# EAGLE design RS232 (EAGLE 4.14)
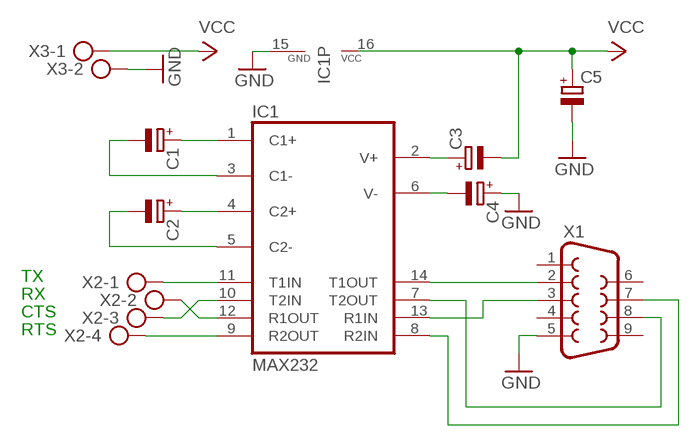
[diagram p0: schematic, sheet 1]

## Parts
C1  CPOL-EUE2-4  [E2-4]
C2  CPOL-EUE2-4  [E2-4]
C3  CPOL-EUE2-4  [E2-4]
C4  CPOL-EUE2-4  [E2-4]
C5  CPOL-EUE2-4  [E2-4]
IC1  MAX232  [DIL16]
X1  F09HP  [F09HP]
X2  AK300/4  [AK300/4]
X3  AK300/2  [AK300/2]

## Nets
GND: C4.+ C5.- IC1.15(GND) X1.5 X3.2
N$1: C1.- IC1.3(C1-)
N$2: C2.- IC1.5(C2-)
N$3: C1.+ IC1.1(C1+)
N$4: C2.+ IC1.4(C2+)
N$5: C4.- IC1.6(V-)
N$6: C3.+ IC1.2(V+)
N$7: IC1.11(T1IN) X2.1
N$8: IC1.12(R1OUT) X2.2
N$9: IC1.14(T1OUT) X1.2
N$10: IC1.7(T2OUT) X1.8
N$11: IC1.13(R1IN) X1.3
N$12: IC1.8(R2IN) X1.7
N$13: IC1.10(T2IN) X2.3
N$14: IC1.9(R2OUT) X2.4
VCC: C3.- C5.+ X3.1
Unconnected: X1.1 X1.4 X1.6 X1.9

## Notes on the sheet
- TX
- RX
- CTS
- RTS

## Power pins joined to a net without a drawn wire
VCC: IC1.16(VCC)

## Library data of the parts
C1-C5 = rcl:CPOL-EU: POLARIZED CAPACITOR, European symbol
IC1 = maxim:MAX232: RS232 TRANSEIVER
X1 = con-subd:F09: SUB-D
X2 = con-ptr500:AK300/4: CONNECTOR
X3 = con-ptr500:AK300/2: CONNECTOR

## Board
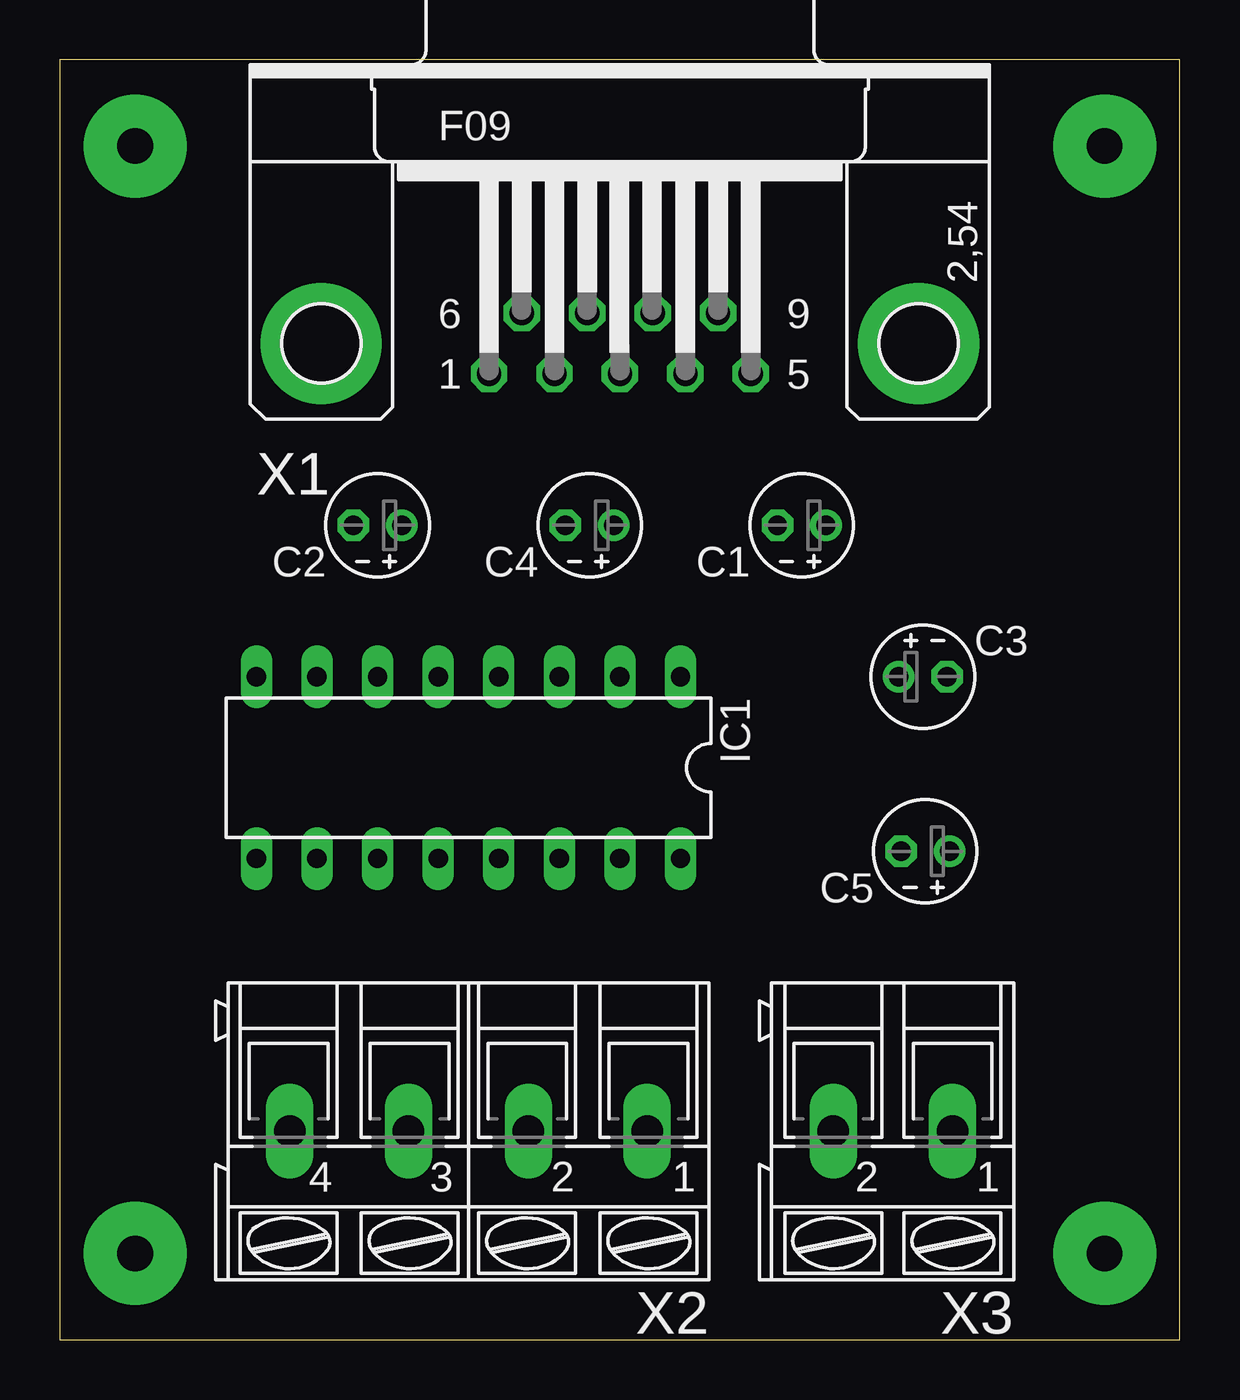
[diagram p1: board, top side]
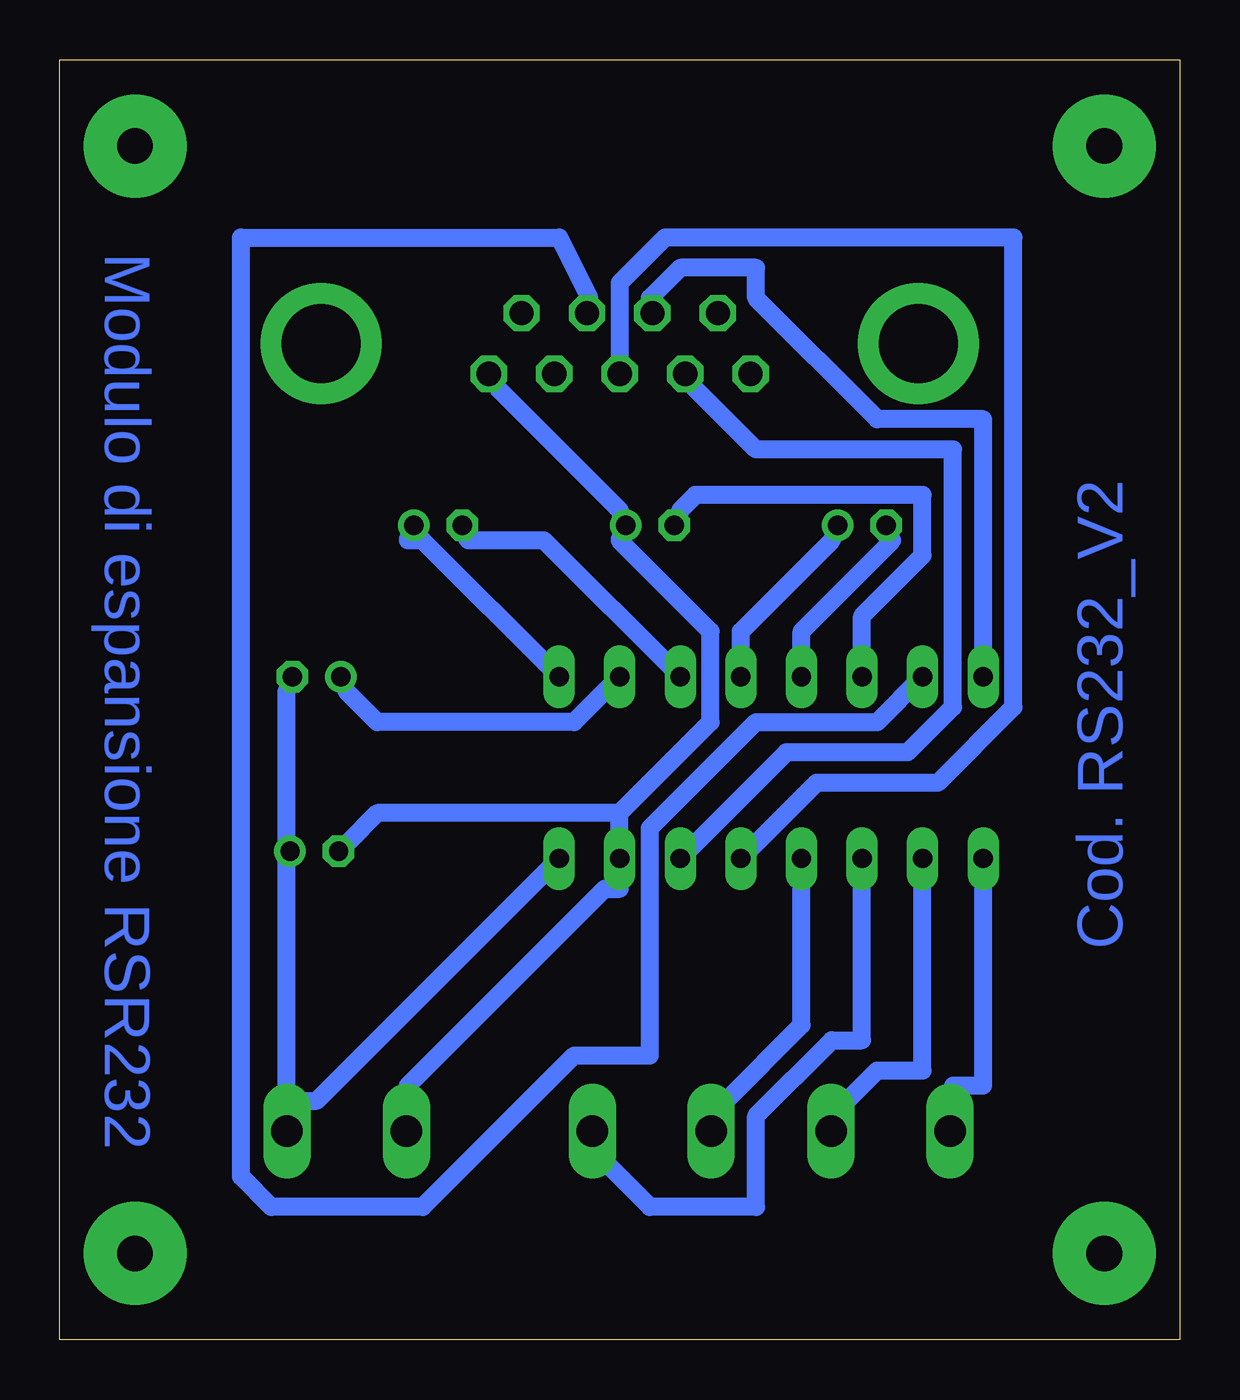
[diagram p2: board, bottom side, seen from below]

Size 46.97 x 53.67 mm. Coordinates in mm from the lower left corner, seen from the top.
Outline: 0,0 46.97,0 46.97,53.67 0,53.67 0,0
Copper layers (1*16): Top 0.035mm / dielectric 1.5mm / Bottom 0.035mm
Design rules "default": minimum track width 30mil, minimum drill 24mil, track to track 8mil, track to pad 8mil, pad to pad 8mil, via to via 8mil, smd to smd 8mil, copper to edge 40mil, drill to drill 8mil, minimum pad ring 10mil, minimum via ring 8mil, stop-mask expansion 4mil, vias tented up to drill 0mil, thermal gap 10mil

### Footprints (pad centres in the part's own frame; a part is rotated, then mirrored left to right if it is on the bottom)
E2-4 = drill 0.813 pad 1.27 round: + -1.016,0 | drill 0.813 pad 1.27 octagon: - 1.016,0
DIL16 = drill 0.813 long: 1 -8.89,-3.81; 2 -6.35,-3.81; 3 -3.81,-3.81; 4 -1.27,-3.81; 5 1.27,-3.81; 6 3.81,-3.81; 7 6.35,-3.81; 8 8.89,-3.81; 9 8.89,3.81; 10 6.35,3.81; 11 3.81,3.81; 12 1.27,3.81; 13 -1.27,3.81; 14 -3.81,3.81; 15 -6.35,3.81; 16 -8.89,3.81
F09HP = drill 1.016 octagon: 1 -5.486,-1.27; 2 -2.743,-1.27; 3 0,-1.27; 4 2.743,-1.27; 5 5.486,-1.27; 6 -4.115,1.27; 7 -1.372,1.27; 8 1.372,1.27; 9 4.115,1.27 | drill 3.302 pad 5.08 round: G1 -12.522,0; G2 12.522,0
AK300/4 = drill 1.321 long: 1 -7.493,0; 2 -2.515,0; 3 2.515,0; 4 7.493,0
AK300/2 = drill 1.321 long: 1 -2.515,0; 2 2.489,0

### Placement (x,y rotation side)
C1  31.11,34.15 180 top
C2  13.33,34.15 180 top
C3  36.19,27.8 0 top
C4  22.22,34.15 180 top
C5  36.29,20.49 180 top
IC1  17.14,23.99 180 top
X1  23.49,41.77 0 top
X2  17.14,8.75 180 top
X3  34.92,8.75 180 top

### Tracks (layer width: path | path; a pad name or v marks a point on that pad's centre or on a via)
GND
  Bottom 0.762: X1.5 28.57,39.87 23.49,34.79 C4.+ 23.49,33.52 19.68,29.71 19.68,25.9 23.49,22.09 | 23.49,22.09 IC1.15 23.49,18.91 24.12,18.91 32.38,10.66 X3.2 | 23.49,22.09 33.65,22.09 34.92,20.82 C5.-
N$1
  Bottom 0.762: IC1.3 26.66,33.52 29.84,33.52 C1.-
N$2
  Bottom 0.762: C2.- 12.06,33.52 15.87,29.71 IC1.5
N$3
  Bottom 0.762: IC1.1 31.74,33.52 32.38,33.52 C1.+
N$4
  Bottom 0.762: C2.+ 14.6,33.52 18.41,29.71 IC1.4
N$5
  Bottom 0.762: IC1.6 13.33,30.34 10.79,32.88 10.79,35.42 20.31,35.42 20.95,34.79 C4.-
N$6
  Bottom 0.762: IC1.2 25.39,25.9 33.65,25.9 34.92,27.17 C3.+
N$7
  Bottom 0.762: IC1.11 13.33,12.56 14.6,12.56 17.77,9.39 17.77,5.58 22.22,5.58 24.12,7.48 X2.1
N$8
  Bottom 0.762: IC1.12 15.87,13.2 19.04,10.02 X2.2
N$9
  Bottom 0.762: IC1.14 16.5,24.63 11.42,24.63 9.52,26.53 9.52,37.33 17.77,37.33 20.31,39.87 X1.2
N$10
  Bottom 0.762: IC1.7 12.69,25.9 17.77,25.9 22.22,21.45 22.22,11.93 25.39,11.93 31.74,5.58 38.09,5.58 39.36,6.85 39.36,46.22 26.03,46.22 24.76,43.68 X1.8
N$11
  Bottom 0.762: IC1.13 15.23,23.36 10.15,23.36 6.98,26.53 6.98,46.22 21.59,46.22 23.49,44.31 X1.3
N$12
  Bottom 0.762: IC1.8 8.25,38.6 12.69,38.6 17.77,43.68 17.77,44.95 20.95,44.95 22.22,43.68 X1.7
N$13
  Bottom 0.762: IC1.10 10.79,11.29 12.69,11.29 13.96,10.02 X2.3
N$14
  Bottom 0.762: IC1.9 8.25,10.66 9.52,10.66 X2.4
N$16  (via drill 1.5 pad 4.32)
  other vias: 43.81,3.62
N$17  (via drill 1.5 pad 4.32)
  other vias: 3.17,50.05
N$19  (via drill 1.5 pad 4.32)
  other vias: 43.81,50.05
N$20  (via drill 1.5 pad 4.32)
  other vias: 3.17,3.62
VCC
  Bottom 0.762: C3.- 37.46,27.17 37.46,20.82 C5.+ 37.46,20.18 37.46,10.66 X3.1 36.82,10.02 36.19,10.02 IC1.16

### Text on the board
Bottom: Modulo di espansione RSR232 | Cod. RS232_V2